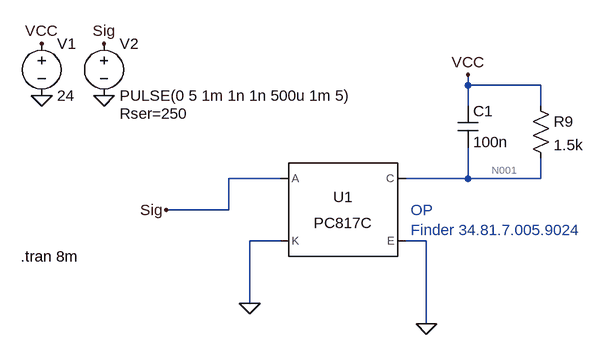
[diagram p0: schematic R2D-Timer_2.asc]
R2D-Timer_2.asc, the LTspice schematic file:
Version 4
SHEET 1 1376 1204
WIRE 192 176 192 160
WIRE 304 176 192 176
WIRE 192 208 192 176
WIRE 304 208 304 176
WIRE -96 320 -176 320
WIRE 192 320 192 272
WIRE 192 320 96 320
WIRE 304 320 304 288
WIRE 304 320 192 320
WIRE -176 368 -176 320
WIRE -176 368 -272 368
WIRE -96 416 -144 416
WIRE 128 416 96 416
WIRE -144 512 -144 416
WIRE 128 544 128 416
FLAG -368 192 0
FLAG -464 192 0
FLAG -464 112 VCC
FLAG -368 112 Sig
FLAG -272 368 Sig
FLAG -144 512 0
FLAG 192 160 VCC
FLAG 128 544 0
SYMBOL voltage -464 96 R0
WINDOW 123 0 0 Left 0
WINDOW 39 0 0 Left 0
SYMATTR InstName V1
SYMATTR Value 24
SYMBOL voltage -368 96 R0
WINDOW 123 0 0 Left 0
WINDOW 39 24 124 Left 2
SYMATTR SpiceLine Rser=250
SYMATTR InstName V2
SYMATTR Value PULSE(0 5 1m 1n 1n 500u 1m 5)
SYMBOL Optos\\PC817C 0 368 R0
SYMATTR InstName U1
SYMBOL cap 176 208 R0
SYMATTR InstName C1
SYMATTR Value 100n
SYMBOL res 288 192 R0
SYMATTR InstName R9
SYMATTR Value 1.5k
TEXT -496 440 Left 2 !.tran 8m
TEXT 104 368 Left 2 ;OP\nFinder 34.81.7.005.9024

The netlist it stands for:
* R2D-Timer_2.asc
V1 VCC 0 24
V2 Sig 0 PULSE(0 5 1m 1n 1n 500u 1m 5) Rser=250
XU1 Sig 0 N001 0 PC817 Igain=2.3m  ; PC817C, pins A K C E
C1 VCC N001 100n
R9 VCC N001 1.5k
.tran 8m
* OP
* Finder 34.81.7.005.9024
.lib PC817.sub
.backanno
.end

* Results of the author's LTspice run, read from the files saved beside the schematic
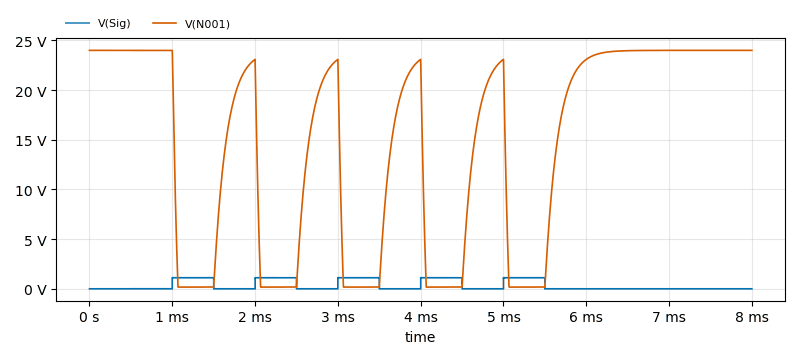
[diagram p1: Transient Analysis of R2D-Timer_2.asc, plotted from the saved traces]
* Transient Analysis, 1 run:
*   V(Sig): min -7.444 µV, max 1.12 V, average 348.3 mV, rms 623 mV, last 0 V
*   V(N001): min 170.5 mV, max 24 V, average 14.75 V, rms 17.97 V, last 24 V